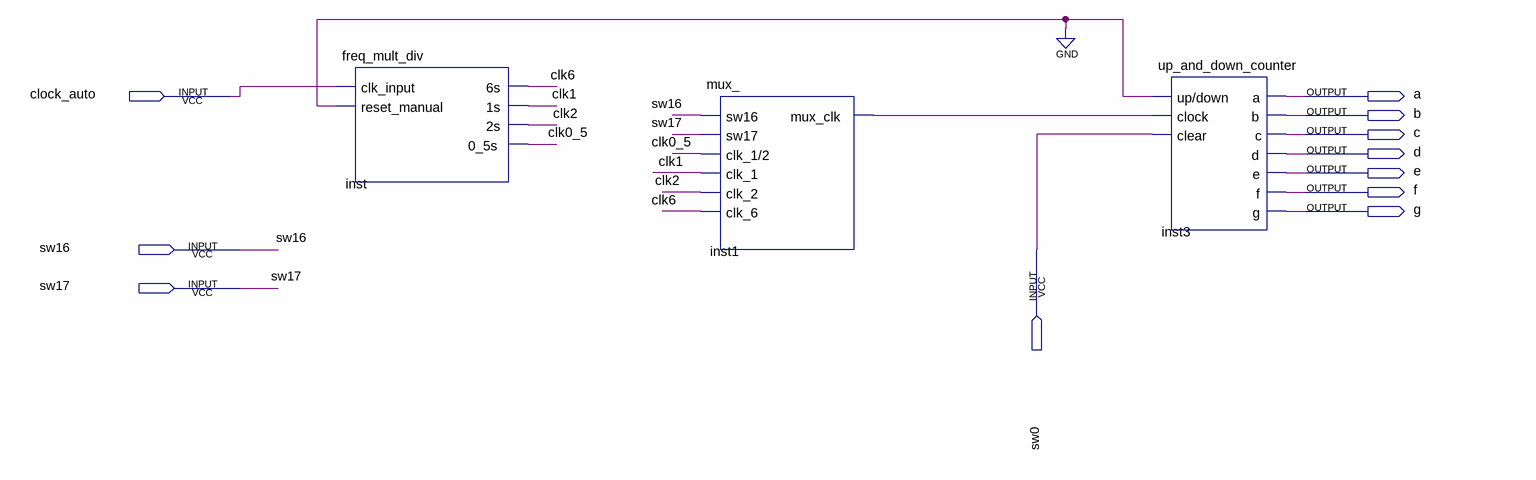
[diagram p0: schematic sheet]
// Quartus schematic automatic_counter_with_mux.bdf as structural Verilog: 3 symbols, 11 pins
module automatic_counter_with_mux (
  input  clock_auto,
  input  sw16,
  input  sw0,
  input  sw17,
  output a,
  output b,
  output c,
  output d,
  output e,
  output f,
  output g
);

  wire clk0_5, clk1, clk2, clk6, inst1_mux_clk;

  freq_mult_div inst (
    .clk_input(clock_auto), .reset_manual(1'b0), .\6s (clk6), .\1s (clk1), .\2s (clk2), .\0_5s (clk0_5));
  mux_ inst1 (
    .sw16(sw16), .sw17(sw17), .\clk_1/2 (clk0_5), .clk_1(clk1), .clk_2(clk2), .clk_6(clk6),
    .mux_clk(inst1_mux_clk));
  up_and_down_counter inst3 (
    .\up/down (1'b0), .clock(inst1_mux_clk), .clear(sw0), .a(a), .b(b), .c(c), .d(d), .e(e), .f(f), .g(g));
endmodule
